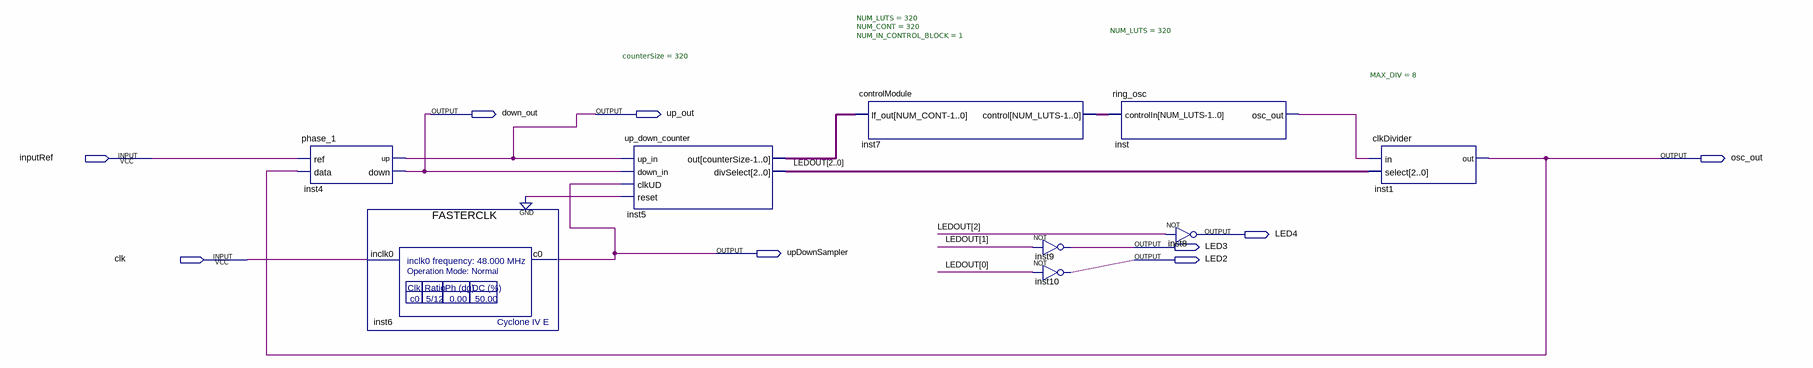
[diagram p0: schematic sheet]
// Quartus schematic top.bdf as structural Verilog: 9 symbols, 9 pins
module top (
  input  inputRef,
  input  clk,
  output down_out,
  output up_out,
  output osc_out,
  output LED4,
  output LED3,
  output upDownSampler,
  output LED2
);

  wire inst_osc_out;
  wire [2:0] LEDOUT;
  wire [319:0] inst5_out, inst7_control;

  phase_1 inst4 (.\ref (inputRef), .data(osc_out), .up(up_out), .down(down_out));
  FASTERCLK inst6 (.inclk0(clk), .c0(upDownSampler));
  up_down_counter #(.counterSize(320)) inst5 (
    .up_in(up_out), .down_in(down_out), .clkUD(upDownSampler), .reset(1'b0), .out(inst5_out),
    .divSelect(LEDOUT));
  controlModule #(.NUM_LUTS(320), .NUM_CONT(320), .NUM_IN_CONTROL_BLOCK(1)) inst7 (
    .lf_out(inst5_out), .control(inst7_control));
  not inst9 (LED3, LEDOUT[1]);
  not inst10 (LED2, LEDOUT[0]);
  ring_osc #(.NUM_LUTS(320)) inst (.controlIn(inst7_control), .osc_out(inst_osc_out));
  not inst8 (LED4, LEDOUT[2]);
  clkDivider #(.MAX_DIV(8)) inst1 (.in(inst_osc_out), .select(LEDOUT), .out(osc_out));
endmodule
